# Altium schematic sheet Remote.SchDoc
size A
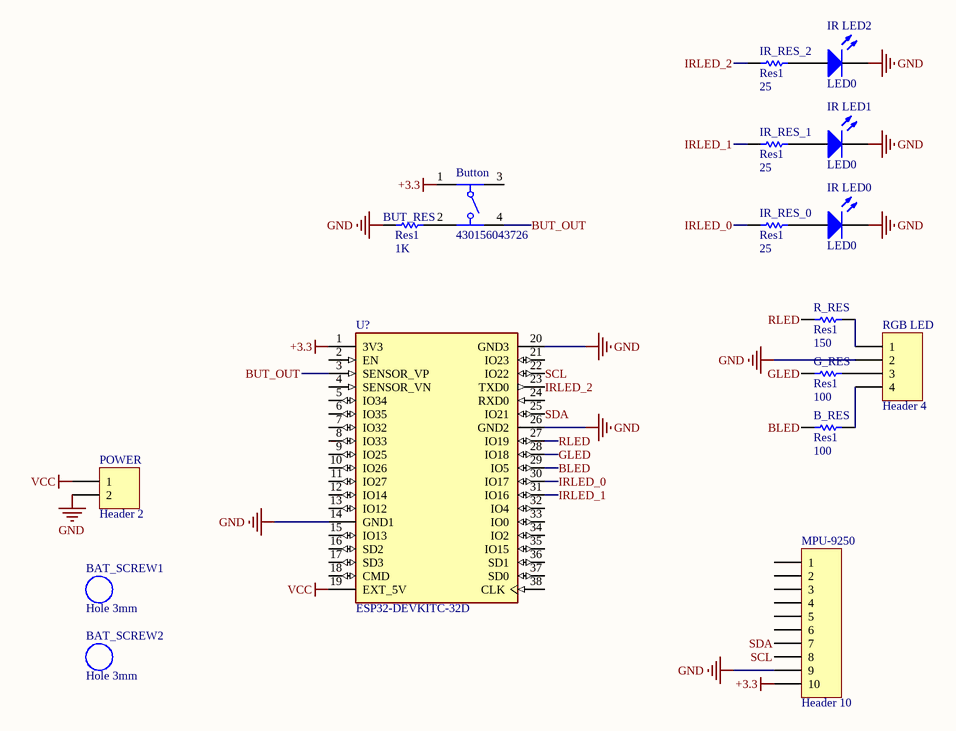
[diagram p0: Remote.SchDoc]

## Parts
B_RES  Res1  value 100  [AXIAL-0.3]
BAT_SCREW1  Hole 3mm  [Hole 3mm]
BAT_SCREW2  Hole 3mm  [Hole 3mm]
BUT_RES  Res1  value 1K  [AXIAL-0.3]
Button  430156043726  [4301x60437x6]
G_RES  Res1  value 100  [AXIAL-0.3]
IR_LED0  LED0  [LED-0]
IR_LED1  LED0  [LED-0]
IR_LED2  LED0  [LED-0]
IR_RES_0  Res1  value 25  [AXIAL-0.3]
IR_RES_1  Res1  value 25  [AXIAL-0.3]
IR_RES_2  Res1  value 25  [AXIAL-0.3]
MPU-9250  Header 10  [HDR1X10]
POWER  Header 2  [HDR1X2]
R_RES  Res1  value 150  [AXIAL-0.3]
RGB_LED  Header 4  [HDR1X4]
U?  ESP32-DEVKITC-32D  [MODULE_ESP32-DEVKITC-32D]

## Nets
+3.3: Button.1 MPU-9250.10 U?.1(3V3)
GND: BUT_RES.1 IR_LED0.2(K) IR_LED1.2(K) IR_LED2.2(K) MPU-9250.9 POWER.2 RGB_LED.2 U?.14(GND1) U?.20(GND3) U?.26(GND2)
VCC: POWER.1 U?.19(EXT_5V)
BLED: B_RES.1 U?.29(IO5)
BUT_OUT: Button.4 U?.3(SENSOR_VP)
GLED: G_RES.1 U?.28(IO18)
IRLED_0: IR_RES_0.1 U?.30(IO17)
IRLED_1: IR_RES_1.1 U?.31(IO16)
IRLED_2: IR_RES_2.1 U?.23(TXD0)
RLED: R_RES.1 U?.27(IO19)
SCL: MPU-9250.8 U?.22(IO22)
SDA: MPU-9250.7 U?.25(IO21)
NetB_RES_2: B_RES.2 RGB_LED.4
NetBUT_RES_2: BUT_RES.2 Button.2
NetG_RES_2: G_RES.2 RGB_LED.3
NetIR_LED0_1: IR_LED0.1(A) IR_RES_0.2
NetIR_LED1_1: IR_LED1.1(A) IR_RES_1.2
NetIR_LED2_1: IR_LED2.1(A) IR_RES_2.2
NetR_RES_2: R_RES.2 RGB_LED.1

Not connected (* = marked no-connect by the designer): Button 3; MPU-9250 1 2 3 4 5 6; U? 2(EN) 4(SENSOR_VN) 5(IO34) 6(IO35) 7(IO32) 8(IO33) 9(IO25) 10(IO26) 11(IO27) 12(IO14) 13(IO12) 15(IO13) 16(SD2) 17(SD3) 18(CMD) 21(IO23) 24(RXD0) 32(IO4) 33(IO0) 34(IO2) 35(IO15) 36(SD1) 37(SD0) 38(CLK)

## Library data of the parts
B_RES BUT_RES G_RES IR_RES_0-IR_RES_2 R_RES = Res1: Resistor; Published: 8-Jun-2000; LatestRevisionDate: 17-Jul-2002; LatestRevisionNote: Re-released for DXP Platform.; PackageReference: AXIAL-0.3; Publisher: Altium Limited; PackageDescription: Axial Device, Thru-Hole; 2 Leads; 0.3 in Pin Spacing
Button = 430156043726: WS-TATV THT Tact Switch 6x6mm, height 4.3mm, 260gf; Rated Voltage: 12VDC; Rated Current: 50mA; Washable: No; ComponentLink1Description: Manufacturer; ComponentLink1URL: http://www.we-online.de; ComponentLink2Description: Datasheet; ComponentLink2URL: https://katalog.we-online.com/em/datasheet/430156043726.pdf; Operating Temperature: -40 to +85degC; Part Number: 430156043726; Published Date: September 2019; Contact Material: Stainless Steel; Height: 4.3mm; Mounting Technology: THT; Contact Plating: Silver; Operation Force: 260gf; Packaging: Bulk; Terminal Material: Copper Alloy; Publisher: Wurth Elektronik; Terminal Plating: Silver
IR_LED0-IR_LED2 = LED0: Typical INFRARED GaAs LED; Published: 8-Jun-2000; LatestRevisionDate: 08-Jul-2005; LatestRevisionNote: Mech Layer 1 removed.; PackageReference: LED-0; Publisher: Altium Limited; PackageDescription: LED; 2 Leads
MPU-9250 = Header 10: Header, 10-Pin; LatestRevisionDate: 17-Jul-2002; LatestRevisionNote: Re-released for DXP Platform.; Publisher: Altium Limited
POWER = Header 2: Header, 2-Pin; LatestRevisionDate: 17-Jul-2002; LatestRevisionNote: Re-released for DXP Platform.; Publisher: Altium Limited
RGB_LED = Header 4: Header, 4-Pin; LatestRevisionDate: 17-Jul-2002; LatestRevisionNote: Re-released for DXP Platform.; Publisher: Altium Limited
U? = ESP32-DEVKITC-32D: - Transceiver; 802.11 b/g/n _Wi-Fi, WiFi, WLAN_, BluetoothÂ® Smart Ready 4.x Dual Mode For Use With ESP-WROOM-32; MF: Espressif Systems; Package: None; Price: None; Availability: Unavailable; MP: ESP32-DEVKITC-32D; SnapEDA_Link: https://www.snapeda.com/parts/ESP32-DEVKITC-32D/Espressif%20Systems/view-part/2777395/?ref=snap; Value: *